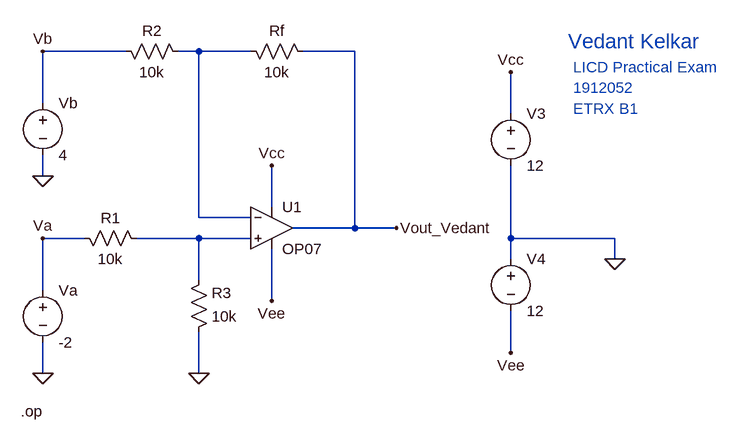
[diagram p0: schematic 1912052_LICD_exp1.asc]
1912052_LICD_exp1.asc, the LTspice schematic file:
Version 4
SHEET 1 980 680
WIRE 32 -96 -96 -96
WIRE 144 -96 112 -96
WIRE 224 -96 144 -96
WIRE 384 -96 304 -96
WIRE -96 -16 -96 -96
WIRE 624 0 624 -64
WIRE -96 96 -96 64
WIRE 256 144 256 80
WIRE 144 160 144 -96
WIRE 224 160 144 160
WIRE 384 176 384 -96
WIRE 384 176 288 176
WIRE 448 176 384 176
WIRE -32 192 -96 192
WIRE 144 192 48 192
WIRE 224 192 144 192
WIRE 624 192 624 80
WIRE 784 192 624 192
WIRE 624 224 624 192
WIRE 784 224 784 192
WIRE 144 256 144 192
WIRE -96 272 -96 192
WIRE 256 288 256 208
WIRE 624 368 624 304
WIRE -96 400 -96 352
WIRE 144 400 144 336
FLAG -96 -96 Vb
FLAG -96 192 Va
FLAG 256 80 Vcc
FLAG 256 288 Vee
FLAG 448 176 Vout_Vedant
FLAG 624 -64 Vcc
FLAG 624 368 Vee
FLAG 144 400 0
FLAG -96 400 0
FLAG -96 96 0
FLAG 784 224 0
SYMBOL OpAmps\\OP07 256 112 R0
SYMATTR InstName U1
SYMBOL res 208 -112 M90
WINDOW 0 0 56 VBottom 2
WINDOW 3 32 56 VTop 2
SYMATTR InstName Rf
SYMATTR Value 10k
SYMBOL res 16 -112 M90
WINDOW 0 0 56 VBottom 2
WINDOW 3 32 56 VTop 2
SYMATTR InstName R2
SYMATTR Value 10k
SYMBOL res -48 176 M90
WINDOW 0 0 56 VBottom 2
WINDOW 3 32 56 VTop 2
SYMATTR InstName R1
SYMATTR Value 10k
SYMBOL res 128 352 M180
WINDOW 0 36 76 Left 2
WINDOW 3 36 40 Left 2
SYMATTR InstName R3
SYMATTR Value 10k
SYMBOL voltage -96 -32 R0
WINDOW 123 0 0 Left 0
WINDOW 39 0 0 Left 0
SYMATTR InstName Vb
SYMATTR Value 4
SYMBOL voltage -96 256 R0
WINDOW 123 0 0 Left 0
WINDOW 39 0 0 Left 0
SYMATTR InstName Va
SYMATTR Value -2
SYMBOL voltage 624 -16 R0
WINDOW 123 0 0 Left 0
WINDOW 39 0 0 Left 0
SYMATTR InstName V3
SYMATTR Value 12
SYMBOL voltage 624 208 R0
WINDOW 123 0 0 Left 0
WINDOW 39 0 0 Left 0
SYMATTR InstName V4
SYMATTR Value 12
TEXT -130 458 Left 2 !.op
TEXT 712 -112 Left 3 ;Vedant Kelkar
TEXT 720 -72 Left 2 ;LICD Practical Exam
TEXT 720 -40 Left 2 ;1912052
TEXT 720 -8 Left 2 ;ETRX B1

The netlist it stands for:
* 1912052_LICD_exp1.asc
XU1 N002 N001 Vcc Vee Vout_Vedant LT1001  ; OP07, pins In+ In- V+ V- OUT
Rf N001 Vout_Vedant 10k
R2 Vb N001 10k
R1 Va N002 10k
R3 0 N002 10k
Vb Vb 0 4
Va Va 0 -2
V3 Vcc 0 12
V4 0 Vee 12
.op
* Vedant Kelkar
* LICD Practical Exam
* 1912052
* ETRX B1
.lib LTC.lib
.backanno
.end